# EAGLE schematic Microduino-SIM-Shield 20140213 (EAGLE 6.4)
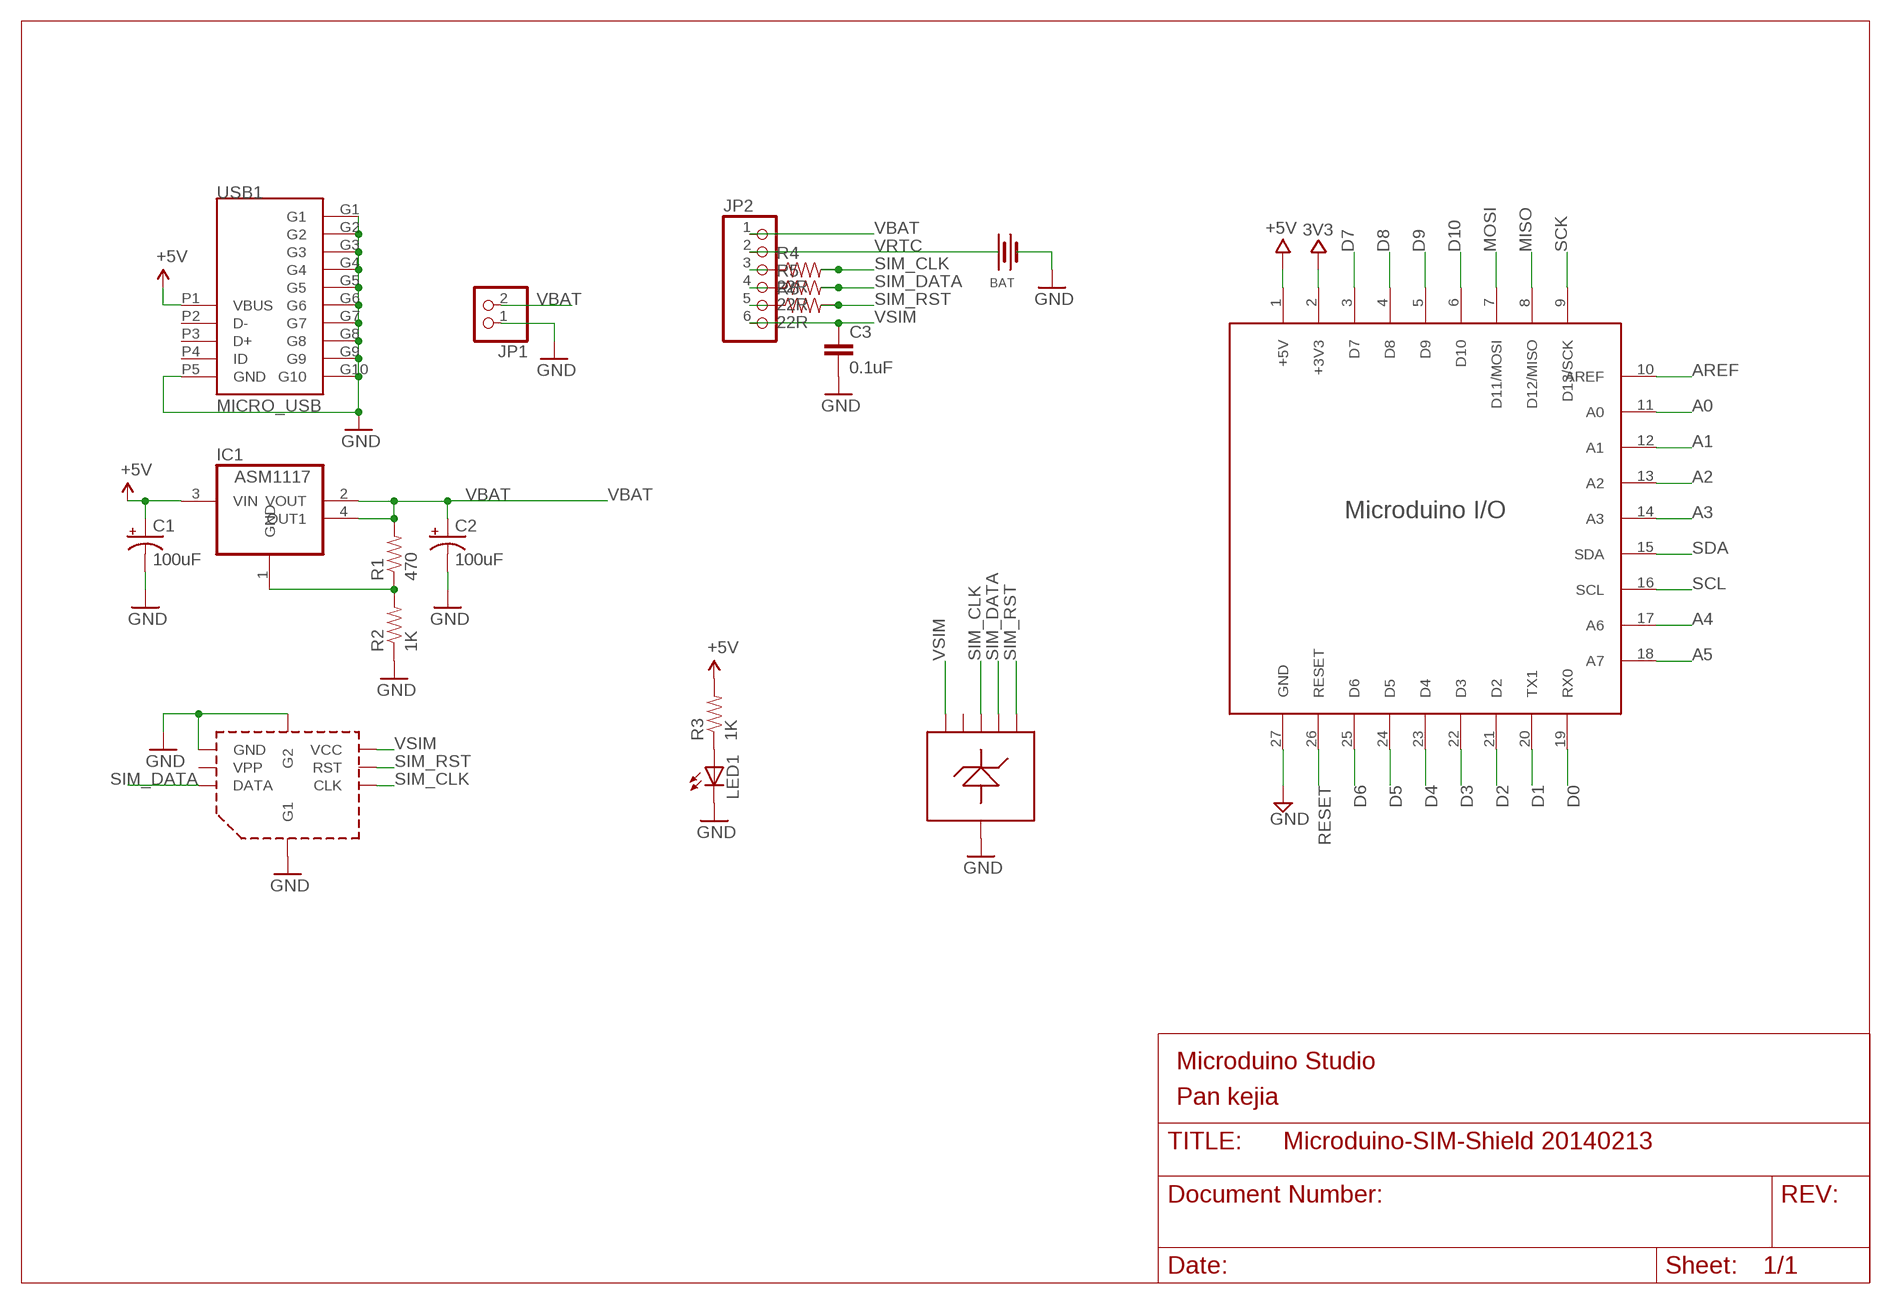
[diagram p0: schematic, sheet 1]

## Parts
BAT  XH414  BATTERY-TS414H  [TS414H]
C1  100uF  CAP_POL3528  [EIA3528]
C2  100uF  CAP_POL3528  [EIA3528]
C3  0.1uF  CAP0603-CAP  [0603-CAP]
IC1  ASM1117  [SOT223]
IC2  SMF05C  [SC70-6L]
JP1  PINHD-1X2D/90  [1X02/90]
JP2  PINHD-1X6  [1X06]
LED1  LED0805  [0805-LED]
R1  470  RESISTOR0603-RES  [0603-RES]
R2  1K  RESISTOR0603-RES  [0603-RES]
R3  1K  RESISTOR0603-RES  [0603-RES]
R4  22R  RESISTOR0603-RES  [0603-RES]
R5  22R  RESISTOR0603-RES  [0603-RES]
R6  22R  RESISTOR0603-RES  [0603-RES]
U$1  MICRDUINO-PIN/NORMAL  [27UPIN-NORMAL]
U$6  SIM  [SIM]
USB1  MICRO_USB  [MICRO_USB_LJ]

## Nets
3V3: U$1.2(+3V3)
+5V: C1.A(+) IC1.3(VIN) R3.2 U$1.1(+5V) USB1.P1(VBUS)
A0: U$1.11(A0)
A1: U$1.12(A1)
A2: U$1.13(A2)
A3: U$1.14(A3)
A4: U$1.17(A6)
A5: U$1.18(A7)
AREF: U$1.10(AREF)
D0: U$1.19(RX0)
D1: U$1.20(TX1)
D2: U$1.21(D2)
D3: U$1.22(D3)
D4: U$1.23(D4)
D5: U$1.24(D5)
D6: U$1.25(D6)
D7: U$1.3(D7)
D8: U$1.4(D8)
D9: U$1.5(D9)
D10: U$1.6(D10)
GND: BAT.2(-) C1.C(-) C2.C(-) C3.2 IC2.P$2 JP1.1 LED1.C R2.1 U$1.27(GND) U$6.5(GND) U$6.P$1(G1) U$6.P$2(G2) USB1.G1 USB1.G2 USB1.G3 USB1.G4 USB1.G5 USB1.G6 USB1.G7 USB1.G8 USB1.G9 USB1.G10 USB1.P5(GND)
MISO: U$1.8(D12/MISO)
MOSI: U$1.7(D11/MOSI)
N$1: LED1.A R3.1
N$2: JP2.3 R4.1
N$3: JP2.4 R5.1
N$4: JP2.5 R6.1
N$5: IC1.1(GND) R1.1 R2.2
RESET: U$1.26(RESET)
SCK: U$1.9(D13/SCK)
SCL: U$1.16(SCL)
SDA: U$1.15(SDA)
SIM_CLK: IC2.P$4 R4.2 U$6.3(CLK)
SIM_DATA: IC2.P$5 R5.2 U$6.7(DATA)
SIM_RST: IC2.P$6 R6.2 U$6.2(RST)
VBAT: C2.A(+) IC1.2(VOUT) IC1.4(OUT1) JP1.2 JP2.1 R1.2
VRTC: BAT.1(+) JP2.2
VSIM: C3.1 IC2.P$1 JP2.6 U$6.1(VCC)
Unconnected: IC2.P$3 U$6.6(VPP) USB1.P2(D-) USB1.P3(D+) USB1.P4(ID)

## Notes on the sheet
- Microduino Studio
- Pan kejia

## Library data of the parts
BAT = microduino:BATTERY
C1 C2 = #_microduino_20131030:CAP_POL: Capacitor Polarized These are standard SMD and PTH capacitors. Normally 10uF, 47uF, and 100uF in electrolytic and tantalum varieties. Always verify the external diameter of the through hole cap, it varies with capacity, voltage, and manufacturer. The EIA devices should be standard.
C3 = #_microduino_20131030:CAP: Capacitor Standard 0603 ceramic capacitor, and 0.1" leaded capacitor.
IC1 = #_microduino_20131030:ASM1117: 800mA and 1A Low Dropout (LDO) Positive Regulator 1.8V, 2.5V, 2.85V, 3.3V, 5V, and Adj; MPN: REG1117; OC_FARNELL: 1097566; OC_NEWARK: 14P6981
IC2 = #_PKJ:SMF05C
JP1 = microduino:PINHD-1X2D: PIN HEADER
JP2 = #_microduino_20131030:PINHD-1X6: PIN HEADER
LED1 = #_microduino_20131030:LED: LEDs Standard schematic elements and footprints for 5mm, 3mm, 1206, and 0603 sized LEDs. 5mm - Spark Fun Electronics SKU : COM-00529 (and others)
R1-R6 = #_microduino_20131030:RESISTOR: Resistor Basic schematic elements and footprints for 0603, 1206, and PTH 1/10th watt (small) resistors.
U$1 = #_microduino_20131030:MICRDUINO-PIN: microduino引脚封装
U$6 = #_PKJ:SIM
USB1 = #_microduino_20131030:MICRO_USB

## Net classes
0 default: width 0.254 mm, drill 0.381 mm, clearance 0.203 mm
2 gnd: width 0.254 mm, drill 0.381 mm, clearance 0.254 mm